# Altium schematic sheet Schematic_Top_Rev4.SchDoc: Top Board
size Tabloid; Address1: Mike Rankin; Address2: @mikerankin; DocumentNumber: .; Revision: 4.0; SheetNumber: 1; SheetTotal: 1
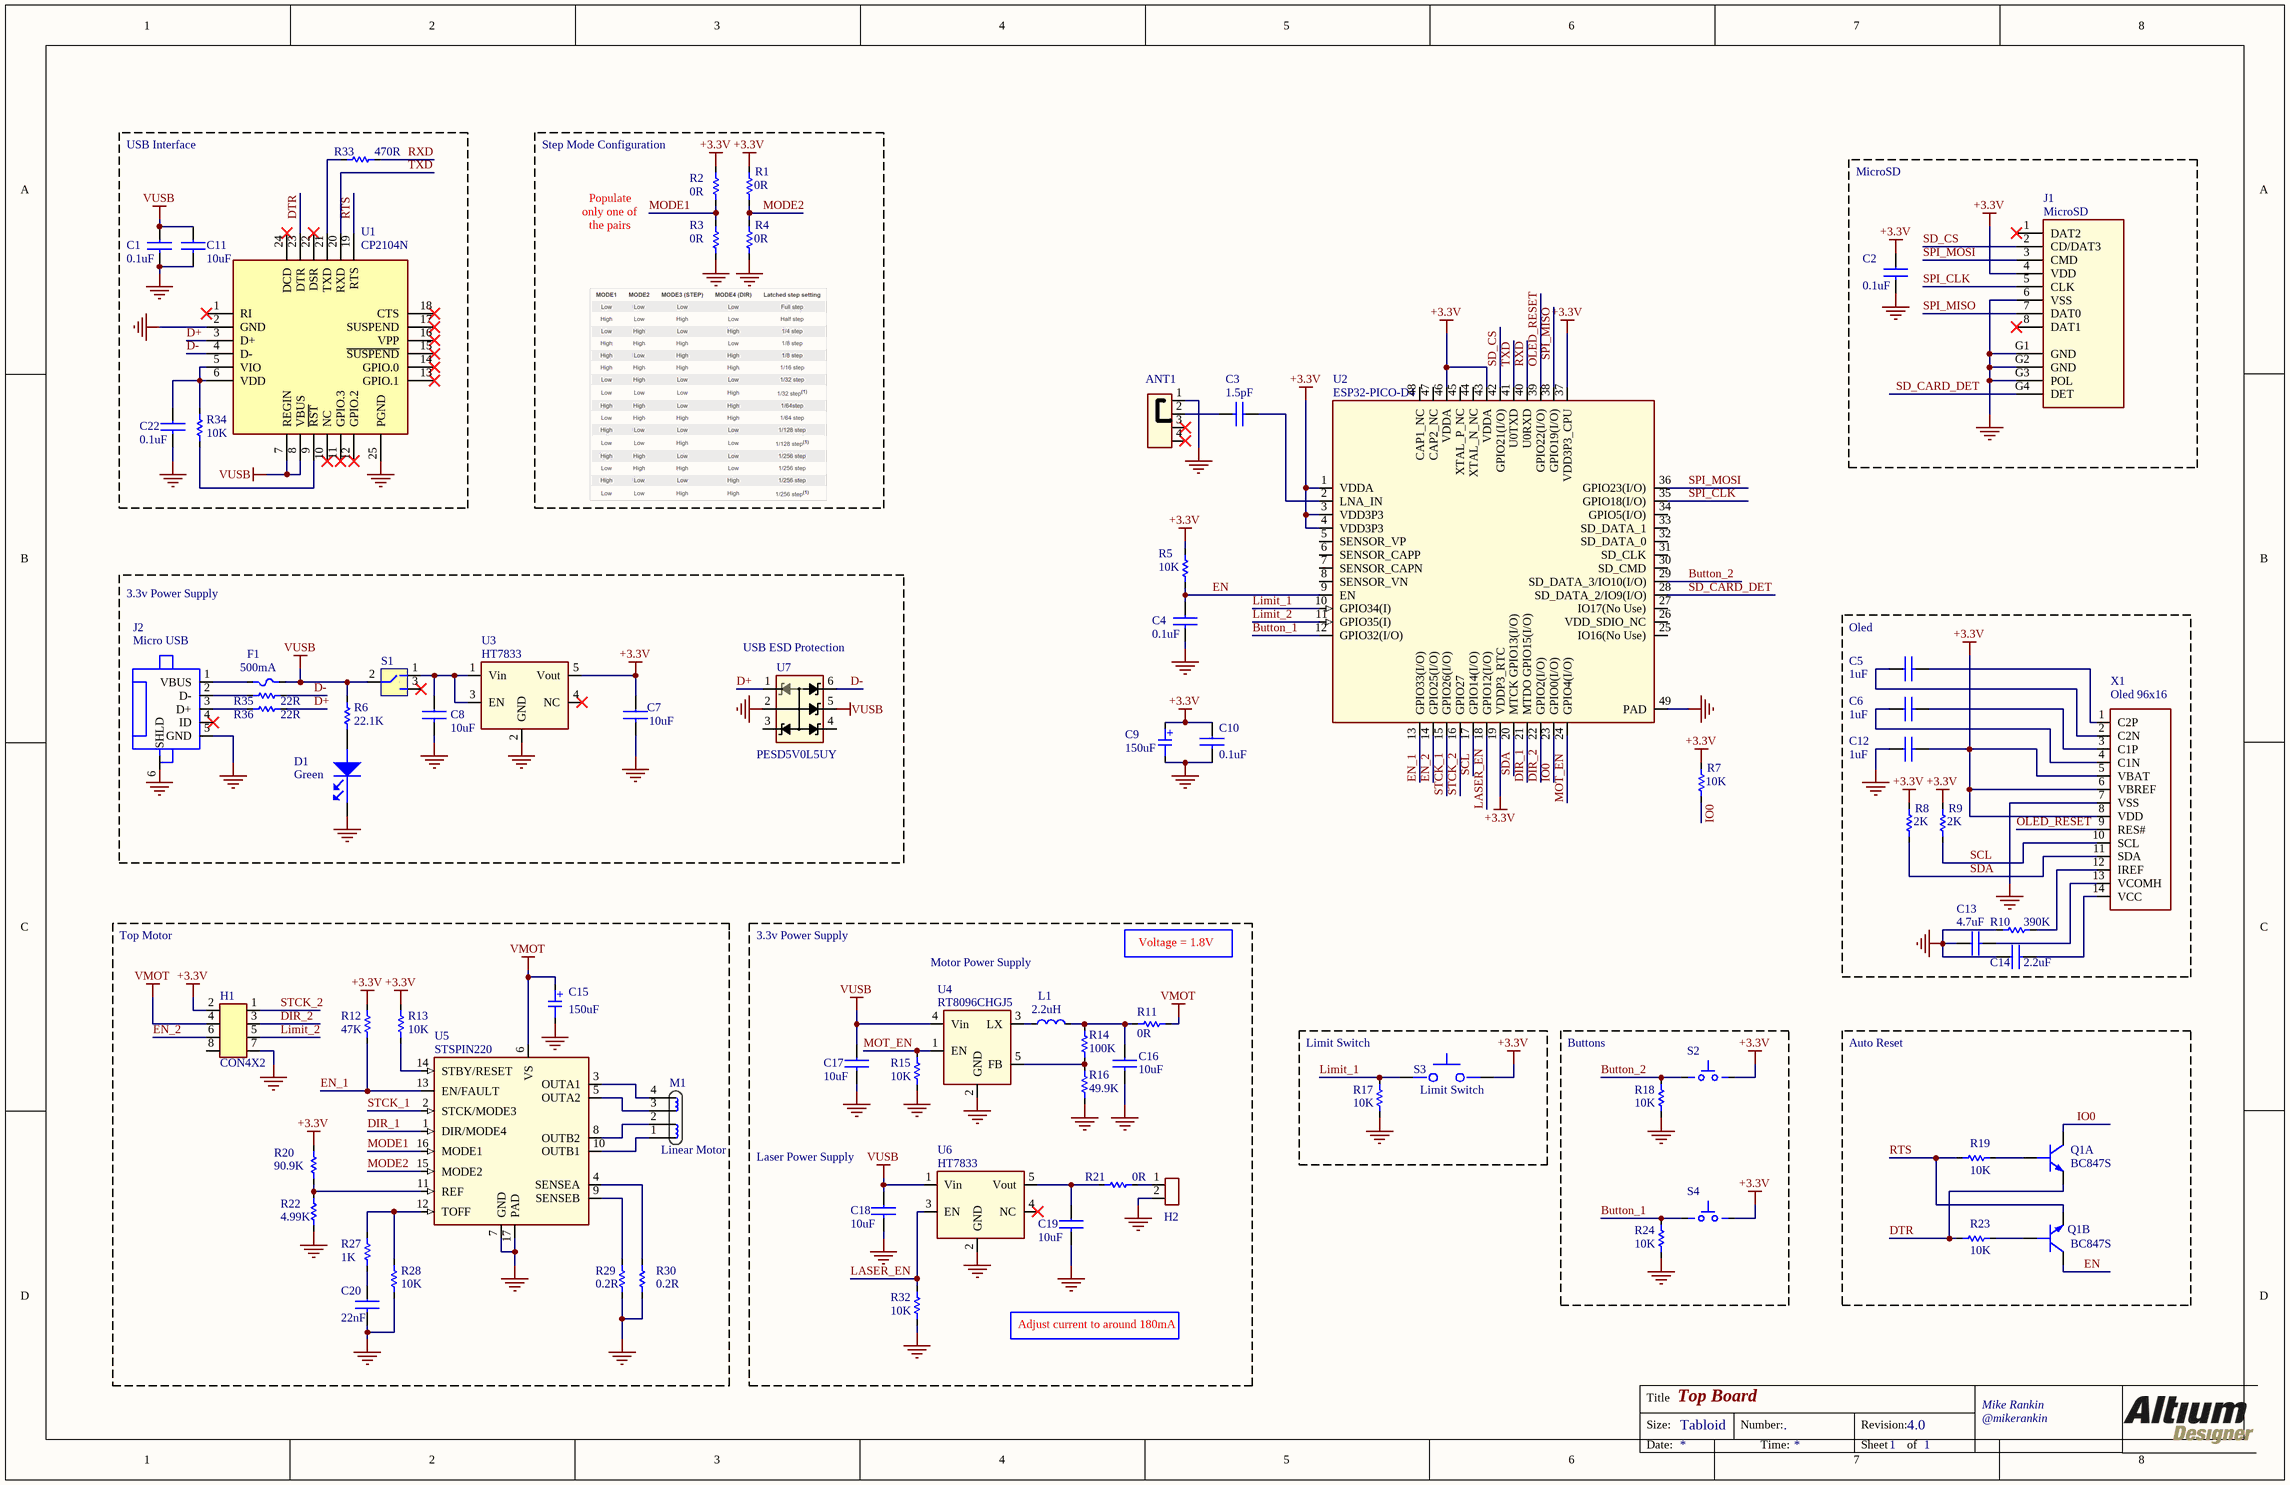
[diagram p0: Schematic_Top_Rev4.SchDoc]

## Parts
ANT1  RF ANT 2.4GHZ STAMPED MET SLD  [PRO-OB-440]  (value not drawn)
C1  0.1uF  [CAPC1005X56N]
C2  0.1uF  [CAPC1005X56N]
C3  1.5pF  [CAPC1005X56N]
C4  0.1uF  [CAPC1005X56N]
C5  1uF  [CAPC1005X56N]
C6  1uF  [CAPC1005X56N]
C7  10uF  [CAPC2012X140N]
C8  10uF  [CAPC2012X140N]
C9  150uF  [CAP_SM_CAN_0.250_DIA]
C10  0.1uF  [CAPC1005X56N]
C11  10uF  [CAPC2012X140N]
C12  1uF  [CAPC1005X56N]
C13  4.7uF  [CAPC1005X56N]
C14  2.2uF  [CAPC1005X56N]
C15  150uF  [CAP_SM_CAN_0.250_DIA]
C16  10uF  [CAPC2012X140N]
C17  10uF  [CAPC2012X140N]
C18  10uF  [CAPC2012X140N]
C19  10uF  [CAPC2012X140N]
C20  22nF  [CAPC1005X56N]
C22  0.1uF  [CAPC1005X56N]
D1  Green  [LED1608X55N-GREEN]
F1  500mA  [PTC2012X70L]
H1  CON4X2  [HDR2X4_RA]
H2  CON2  [HDR1X2-EMPTY]  (value not drawn)  (no BOM)
J1  MicroSD  [0473092851]
J2  Micro USB  [U254-051N-4BH806]
L1  2.2uH  [IND_2mmx2mm]
M1  Linear Motor  [Motor_Mini_Linear_1]
Q1  BC847S  [SOT65P210X110-6N]  (parts A,B of 2)
R1  0R  [RESC1005X40L]
R2  0R  [RESC1005X40L]
R3  0R  [RESC1005X40L]
R4  0R  [RESC1005X40L]
R5  10K  [RESC1005X40L]
R6  22.1K  [RESC1005X40L]
R7  10K  [RESC1005X40L]
R8  2K  [RESC1005X40L]
R9  2K  [RESC1005X40L]
R10  390K  [RESC1005X40L]
R11  0R  [RESC1005X40L]
R12  47K  [RESC1005X40L]
R13  10K  [RESC1005X40L]
R14  100K  [RESC1005X40L]
R15  10K  [RESC1005X40L]
R16  49.9K  [RESC1005X40L]
R17  10K  [RESC1005X40L]
R18  10K  [RESC1005X40L]
R19  10K  [RESC1005X40L]
R20  90.9K  [RESC1005X40L]
R21  0R  [RESC1005X40L]
R22  4.99K  [RESC1005X40L]
R23  10K  [RESC1005X40L]
R24  10K  [RESC1005X40L]
R27  1K  [RESC1005X40L]
R28  10K  [RESC1005X40L]
R29  0.2R  [RESC1005X40L]
R30  0.2R  [RESC1005X40L]
R32  10K  [RESC1005X40L]
R33  470R  [RESC1005X40L]
R34  10K  [RESC1005X40L]
R35  22R  [RESC1005X40L]
R36  22R  [RESC1005X40L]
S1  Toggle Switch  [SK-3245D-02-L4]  (value not drawn)
S2  Pushbutton  [TL1015AF160QG]  (value not drawn)
S3  Limit Switch  [SSCQ110100]
S4  Pushbutton  [TL1015AF160QG]  (value not drawn)
U1  CP2104N  [24-QFN]
U2  ESP32-PICO-D4  [QFN48]
U3  HT7833  [SOT95P280X144-5N]
U4  RT8096CHGJ5  [SOT95P280X144-5N]
U5  STSPIN220  [16QFN]
U6  HT7833  [SOT95P280X144-5N]
U7  PESD5V0L5UY  [SOT65P210X110-6N]
X1  OLED_GLASS 96x16  [OLED_GLASS 96x16]  (value not drawn)

## Blocks framed on the sheet
USB Interface: C1 C11 C22 R33 R34 U1
MicroSD: C2 J1
Top Motor: C15 C20 H1 M1 R12 R13 R20 R22 R27-R30 U5
Limit Switch: R17 S3
Buttons: R18 R24 S2 S4
Auto Reset: Q1 R19 R23

## Nets
+3.3V: C2.1 C7.1 C9.1 C10.1 C12.2 H1.2 J1.4(VDD) R1.1 R2.2 R5.1 R7.1 R8.1 R9.1 R12.2 R13.2 R20.2 S2.2(B) S3.2(B) S4.2(B) U2.1(VDDA) U2.3(VDD3P3) U2.4(VDD3P3) U2.19(VDDP3_RTC) U2.37(VDD3P3_CPU) U2.43(VDDA) U2.46(VDDA) U3.5(Vout) X1.5(VBAT) X1.6(VBREF) X1.8(VDD)
GND: ANT1.1 C1.2 C2.2 C4.2 C7.2 C8.2 C9.2 C10.2 C11.2 C12.1 C13.1 C14.1 C15.2 C16.2 C17.2 C18.2 C19.2 C20.2 C22.2 D1.1(CATHODE) H1.7 H2.2 J1.6(VSS) J1.G1(GND) J1.G2(GND) J1.G3(POL) J2.5(GND) J2.6(SHLD) R3.2 R4.2 R10.1 R15.1 R16.1 R17.2 R18.2 R22.1 R24.2 R28.1 R29.1 R30.1 R32.1 U1.2(GND) U1.25(PGND) U2.49(PAD) U3.2(GND) U4.2(GND) U5.7(GND) U5.17(PAD) U6.2(GND) U7.2 X1.7(VSS)
VMOT: C15.1 H1.4 R11.1 U5.6(VS)
VUSB: C1.1 C11.1 C17.1 C18.1 F1.1 R6.2 S1.2 U1.7(REGIN) U1.8(VBUS) U4.4(Vin) U6.1(Vin) U7.5
Button_1: R24.1 S4.1(A) U2.12(GPIO32(I/O))
Button_2: R18.1 S2.1(A) U2.29(SD_DATA_3/IO10(I/O))
D+: R36.1 U1.3(D+) U7.1
D-: R35.1 U1.4(D-) U7.6
DIR_1: U2.21(MTDO_GPIO15(I/O)) U5.1(DIR/MODE4)
DIR_2: H1.3 U2.22(GPIO2(I/O))
DTR: Q1.1(E1) R23.2 U1.23(DTR)
EN: C4.1 Q1.3(C2) R5.2 U2.9(EN)
EN_1: R12.1 U2.13(GPIO33(I/O)) U5.13(EN/FAULT)
EN_2: H1.6 U2.14(GPIO25(I/O))
IO0: Q1.6(C1) R7.2 U2.23(GPIO0(I/O))
LASER_EN: R32.2 U2.18(GPIO12(I/O)) U6.3(EN)
Limit_1: R17.1 S3.1(A) U2.10(GPIO34(I))
Limit_2: H1.5 U2.11(GPIO35(I))
MODE1: R2.1 R3.1 U5.16(MODE1)
MODE2: R1.2 R4.1 U5.15(MODE2)
MOT_EN: R15.2 U2.24(GPIO4(I/O)) U4.1(EN)
OLED_RESET: U2.39(GPIO22(I/O)) X1.9(RES#)
RTS: Q1.4(E2) R19.2 U1.19(RTS)
RXD: R33.1 U2.40(U0RXD)
SCL: R9.2 U2.17(GPIO14(I/O)) X1.10(SCL)
SD_CARD_DET: J1.G4(DET) U2.28(SD_DATA_2/IO9(I/O))
SD_CS: J1.2(CD/DAT3) U2.42(GPIO21(I/O))
SDA: R8.2 U2.20(MTCK_GPIO13(I/O)) X1.11(SDA)
SPI_CLK: J1.5(CLK) U2.35(GPIO18(I/O))
SPI_MISO: J1.7(DAT0) U2.38(GPIO19(I/O))
SPI_MOSI: J1.3(CMD) U2.36(GPIO23(I/O))
STCK_1: U2.15(GPIO26(I/O)) U5.2(STCK/MODE3)
STCK_2: H1.1 U2.16(GPIO27)
TXD: U1.20(RXD) U2.41(U0TXD)
NetANT1_2: ANT1.2 C3.2
NetC3_1: C3.1 U2.2(LNA_IN)
NetC5_1: C5.1 X1.2(C2N)
NetC5_2: C5.2 X1.1(C2P)
NetC6_1: C6.1 X1.4(C1N)
NetC6_2: C6.2 X1.3(C1P)
NetC8_1: C8.1 S1.1 U3.1(Vin) U3.3(EN)
NetC13_2: C13.2 X1.13(VCOMH)
NetC14_2: C14.2 X1.14(VCC)
NetC16_1: C16.1 L1.2 R11.2 R14.2
NetC19_1: C19.1 R21.1 U6.5(Vout)
NetC20_1: C20.1 R27.1
NetC22_1: C22.1 R34.1 U1.5(VIO) U1.6(VDD)
NetD1_2: D1.2(ANODE) R6.1
NetF1_2: F1.2 J2.1(VBUS)
NetH2_1: H2.1 R21.2
NetJ2_2: J2.2(D-) R35.2
NetJ2_3: J2.3(D+) R36.2
NetL1_1: L1.1 U4.3(LX)
NetM1_1: M1.1 U5.10(OUTB1)
NetM1_2: M1.2 U5.8(OUTB2)
NetM1_3: M1.3 U5.5(OUTA2)
NetM1_4: M1.4 U5.3(OUTA1)
NetQ1_2: Q1.2(B1) R19.1
NetQ1_5: Q1.5(B2) R23.1
NetR10_2: R10.2 X1.12(IREF)
NetR13_1: R13.1 U5.14(STBY/RESET)
NetR14_1: R14.1 R16.2 U4.5(FB)
NetR20_1: R20.1 R22.2 U5.11(REF)
NetR27_2: R27.2 R28.2 U5.12(TOFF)
NetR29_2: R29.2 U5.9(SENSEB)
NetR30_2: R30.2 U5.4(SENSEA)
NetR33_2: R33.2 U1.21(TXD)
NetR34_2: R34.2 U1.9(~{RST})

Not connected (* = marked no-connect by the designer): ANT1 3* 4*; H1 8; J1 1(DAT2)* 8(DAT1)*; J2 4(ID)*; S1 3*; U1 1(RI)* 10(NC)* 11(GPIO.3)* 12(GPIO.2)* 13(GPIO.1)* 14(GPIO.0)* 15(~{SUSPEND})* 16(VPP)* 17(SUSPEND)* 18(CTS)* 22(DSR)* 24(DCD)*; U2 5(SENSOR_VP) 6(SENSOR_CAPP) 7(SENSOR_CAPN) 8(SENSOR_VN) 25(IO16(No_Use)) 26(VDD_SDIO_NC) 27(IO17(No_Use)) 30(SD_CMD) 31(SD_CLK) 32(SD_DATA_0) 33(SD_DATA_1) 34(GPIO5(I/O)) 44(XTAL_N_NC) 45(XTAL_P_NC) 47(CAP2_NC) 48(CAP1_NC); U3 4(NC)*; U6 4(NC)*; U7 3 4

## Notes on the sheet
- (near R2) Step Mode Configuration
- only one of
- Populate
- the pairs
- 3.3v Power Supply
- (near C5) Oled
- (near U7) USB ESD Protection
- (near X1) Oled 96x16
- Motor Power Supply
- Voltage = 1.8V
- (near C18) Laser Power Supply
- Adjust current to around 180mA
- Title
- Size:
- Tabloid
- Number:
- Revision:
- Date:
- Time:
- Sheet
- of
- (in symbol CAP_ELEC_SMT) +

## Library data of the parts
ANT1 = PRO-OB-440: Manufacturer: Proant AB; Part_Footprint: SMT; Vendor: Digi-Key; Value: RF ANT 2.4GHZ STAMPED MET SLD; Part_Number: PRO-OB-440
C1 C2 C4 C10 C22 = CAP_0402: CAP 0.1uF 16V 0402; Part_Number: C60474; Manufacturer: Yageo; Part_Footprint: 0402; Vendor: LCSC; Value: 0.1uF
C3 = CAP_0402: CAP 1.5pF 0402; Part_Number: C147344; Manufacturer: Dafron; Part_Footprint: 0402; Vendor: LCSC; Value: 1.5pF
C5 C6 C12 = CAP_0402: CAP 0.1uF 16V 0402; Part_Number: C29266; Manufacturer: Samsung; Part_Footprint: 0402; Vendor: LCSC; Value: 1uF
C7 C8 C11 C16 C18 C19 = CAP_0805: CAP 10uF 16V 0805; Manufacturer: Murata; Part_Number: C162317; Part_Footprint: 0805; Vendor: LCSC; Value: 10uF
C9 C15 = CAP_ELEC_SMT: CAP 150uF, 10V SMT; Part_Number: C242018; Manufacturer: Suncon; Part_Footprint: SMD,6.3x6mm; Vendor: LCSC; Value: 150uF
C13 = CAP_0402: CAP 4.7uF 16V 0402; Part_Number: C318563; Manufacturer: Samsung; Part_Footprint: 0402; Vendor: LCSC; Value: 4.7uF
C14 = CAP_0402: CAP 2.2uF 16V 0402; Part_Number: C170151; Manufacturer: Samsung; Part_Footprint: 0402; Vendor: LCSC; Value: 2.2uF
C17 = CAP_0805: CAP 10uF 16V 0805; Manufacturer: Murata; Part_Number: C162317; Part_Foorprint: 0805; Vendor: LCSC; Value: 10uF
C20 = CAP_0402: CAP 22nF 16V 0402; Part_Number: C318579; Manufacturer: Samsung; Part_Footprint: 0402; Vendor: LCSC; Value: 22nF
D1 = LED_0603: LED Green 0603; Manufacturer: Orient; Part_Number: C205443; Part_Footprint: 0603; Vendor: LCSC; Value: Green
F1 = PTC_FUSE: 6V 1A 100ms 0805 PTC Resettable Fuse; Manufacturer: TLC; Part_Number: C261942; Part_Footprint: 0805; Vendor: LCSC; Value: 1A Fuse
H1 = CON4X2_M: CONN HEADER 4X2 POS .100" RA; Part_Number: C358706; Manufacturer: MINTRON; Value: Male 4X2; Vendor: LCSC; Part_Footprint: 4X2
H2 = CON2-EMPTY_PAD: EMPTY SOLDER 2POS
J1 = 0473092851: 9 (8 + 1) microSD SMT, Right Angle; Manufacturer: Molex; Vendor: Digi-Key; Part_Number: 0473092851; Value: MicroSD
J2 = U254-051N-4BH806: CONN RECPT MICRO USB; Manufacturer: XKB; Part_Number: C319170; Part_Footprint: SMT; Vendor: LCSC; Value: Micro USB
L1 = Inductor: Inductor 2.2uH 1.45A 2.0 x 2.0mm; Part_Number: C90329; Manufacturer: Taiyo Yuden; Vendor: LCSC; Value: 2.2uH; Part_Footprint: 2.0 x 2.0mm
M1 = Motor_Mini_Linear: MTR,LINEAR,SMT; Part_Number: shorturl.at/cQ269; Vendor: Aliexpress; ComponentLink1Description: Link; ComponentLink1URL: https://www.aliexpress.com/item/4000084515397.html?spm=a2g0s.9042311.0.0.27424c4d28cMfv; Value: Linear Motor
Q1 = BC847S: TRANS 2NPN 44V 0.1A SC-70-6; Manufacturer: Changjiang; Part_Number: C148112; Part_Footprint: SC-70; Vendor: LCSC; Value: BC847S
R1-R4 = RES_0402: RES 0R 0402; Manufacturer: Uniroyal; Part_Footprint: 0402; Vendor: LCSC; Value: 0R
R5 R7 R13 R15 R17-R19 R23 R24 R28 R32 R34 = RES_0402: RES 10K 0402; Part_Number: C25744; Manufacturer: Uniroyal; Part_Footprint: 0402; Vendor: LCSC; Value: 10K
R6 = RES_0603: RES 22.1K 0402; Manufacturer: Uniroyal; Part_Number: C43473; Part_Footprint: 0402; Vendor: LCSC; Value: 22.1K
R8 R9 = RES_0402: RES 2K 0402; Part_Number: C4109; Manufacturer: Uniroyal; Part_Footprint: 0402; Vendor: LCSC; Value: 2K
R10 = RES_0402: RES 390K 0402; Part_Number: C25782; Manufacturer: Uniroyal; Part_Footprint: 0402; Vendor: LCSC; Value: 390K
R11 R21 = RES_0402: RES 0R 0402; Part_Number: C17168; Manufacturer: Uniroyal; Part_Footprint: 0402; Vendor: LCSC; Value: 0R
R12 = RES_0402: RES 47K 0402; Part_Number: C25792; Manufacturer: Uniroyal; Part_Footprint: 0402; Vendor: LCSC; Value: 47K
R14 = RES_0402: RES 100K 0402; Part_Number: C25741; Manufacturer: Uniroyal; Vendor: LCSC; Value: 100K
R16 = RES_0402: RES 49.9K 0402; Part_Number: C25897; Manufacturer: Uniroyal; Vendor: LCSC; Value: 49.9K
R20 = RES_0402: RES 90.9K 0402; Part_Number: C26989; Manufacturer: Uniroyal; Part_Footprint: 0402; Vendor: LCSC; Value: 90.9K
R22 = RES_0402: RES 4.99K 0402; Part_Number: C25903; Manufacturer: Uniroyal; Part_Footprint: 0402; Vendor: LCSC; Value: 4.99K
R27 = RES_0402: RES 1K 0402; Part_Number: C11702; Manufacturer: Uniroyal; Part_Footprint: 0402; Vendor: LCSC; Value: 1K
R29 R30 = RES_0402: RES 0.2R 0402; Part_Number: C270629; Manufacturer: Uniroyal; Part_Footprint: 0402; Vendor: LCSC; Value: 0.2R
R33 = RES_0402: RES 470R 0402; Part_Number: C25117; Manufacturer: Uniroyal; Part_Footprint: 0402; Vendor: LCSC; Value: 470R
R35 R36 = RES_0402: RES 22R 0402; Part_Number: C25092; Manufacturer: Uniroyal; Part_Footprint: 0402; Vendor: LCSC; Value: 22R
S1 = SK-3245D-02-L4: Toggle Switch Thu Hole; Manufacturer: XKB; Part_Number: C381099; Part_Footprint: Thru Hole; Vendor: LCSC; Value: Toggle Switch
S2 S4 = TL1015AF160QG: Switch SMD,3x4x2.5mm; Part_Number: C455281; Manufacturer: Xunpu; Vendor: LCSC; Part_Footprint: SMD; Value: Pushbutton
S3 = SSCQ110100: SWITCH DETECT, DUAL, SMD,R/A; Part_Number: C231760; Manufacturer: Alps; Vendor: LCSC; Part_Footprint: SMD; Value: Limit Switch
U1 = CP2104N: IC BRIDGE USB TO UART 24QFN; Manufacturer: Silicon Labs; Part_Number: CP2104-F03-GMR; Vendor: LCSC; Part_Footprint: 24QFN; Value: CP2104N
U2 = ESP32-PICO-D4: WIFI/Bluetooth, QFN-48 7x7; Manufacturer: Espressif; Vendor: LCSC; Value: ESP32-PICO-D4; Part_Number: ESP32-PICO-D4; Part_Footprint: QFN48
U3 U6 = HT7833: IC LDO 3.3V 0.5A SOT23-5; Manufacturer: Holtek; Part_Number: C164106; Part_Footprint: SOT-23; Vendor: LCSC; Value: HT7833
U4 = RT8096CHGJ5: IC DC SWITCHING REG 1A SOT23-5; Manufacturer: Richtek; Part_Footprint: SOT-23; Vendor: LCSC; Value: Step Down; Part_Number: RT8096CHGJ5
U5 = STSPIN220: IC STEPPER MOTOR DRIVER 16-VFQFPN(3x3); Manufacturer: ST Micro; Part_Footprint: 16-VFQFPM(3x3); Vendor: Digi-Key; Part_Number: STSPIN220
U7 = PESD5V0L5UY: TVS 5V SOT-363; Manufacturer: Yenji; Vendor: LCSC; Value: ESD; Part_Number: PESD5V0L5UY; Part_Footprint: SOT-363
X1 = OLED_GLASS 96x16: 96x16 OLED_GLASS; Part_Number: ER-OLED0.69-1W; Vendor: Buy-Display